# EAGLE design BANTI (EAGLE 9.6.1)
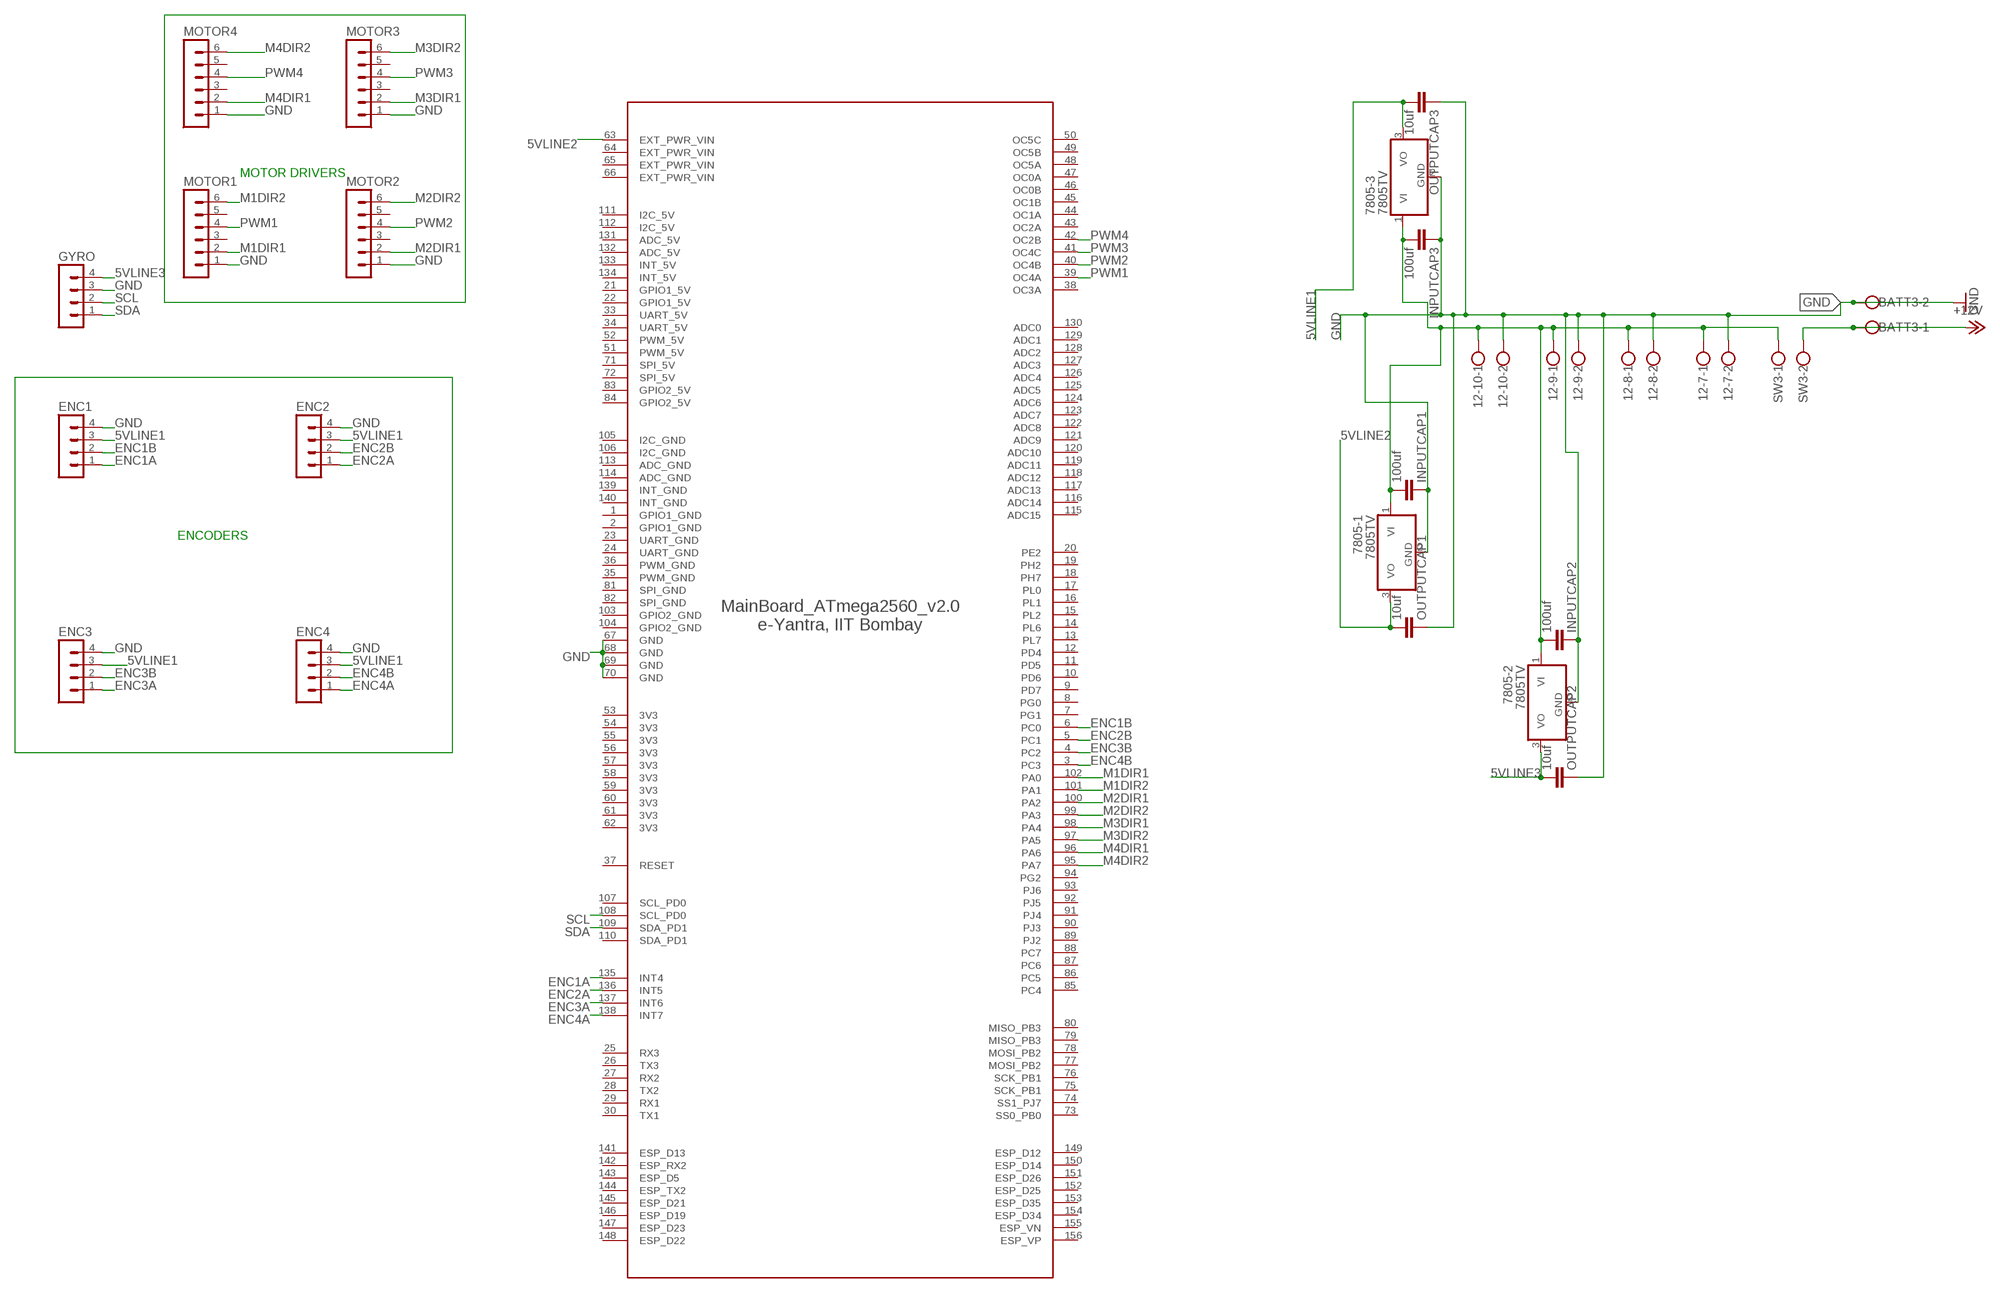
[diagram p0: schematic, sheet 1]

## Parts
12-7  W237-102  [W237-102]
12-8  W237-102  [W237-102]
12-9  W237-102  [W237-102]
12-10  W237-102  [W237-102]
7805-1  7805TV  [TO220V]
7805-2  7805TV  [TO220V]
7805-3  7805TV  [TO220V]
BATT3  W237-102  [W237-102]
ENC1  MA04-1  [MA04-1]
ENC2  MA04-1  [MA04-1]
ENC3  MA04-1  [MA04-1]
ENC4  MA04-1  [MA04-1]
EYFI  ATMEGA2560_V2.0  [ATMEGA2560_V2.0]
GYRO  MA04-1  [MA04-1]
INPUTCAP1  100uf  C2.5/2  [C2.5-2]
INPUTCAP2  100uf  C2.5/2  [C2.5-2]
INPUTCAP3  100uf  C2.5/2  [C2.5-2]
MOTOR1  MA06-1  [MA06-1]
MOTOR2  MA06-1  [MA06-1]
MOTOR3  MA06-1  [MA06-1]
MOTOR4  MA06-1  [MA06-1]
OUTPUTCAP1  10uf  C2.5/2  [C2.5-2]
OUTPUTCAP2  10uf  C2.5/2  [C2.5-2]
OUTPUTCAP3  10uf  C2.5/2  [C2.5-2]
SW3  W237-102  [W237-102]

## Nets
5VLINE1: 7805-3.3(VO) ENC1.3 ENC2.3 ENC3.3 ENC4.3 OUTPUTCAP3.2
5VLINE2: 7805-1.3(VO) EYFI.63(EXT_PWR_VIN) OUTPUTCAP1.2
5VLINE3: 7805-2.3(VO) GYRO.4 OUTPUTCAP2.2
12VLINE1 [twelvevolt]: 12-7.1 12-8.1 12-9.1 12-10.1 7805-1.1(VI) 7805-2.1(VI) 7805-3.1(VI) INPUTCAP1.2 INPUTCAP2.2 INPUTCAP3.2 SW3.1
+12V: BATT3.1 SW3.2
ENC1A: ENC1.1 EYFI.135(INT4)
ENC1B: ENC1.2 EYFI.6(PC0)
ENC2A: ENC2.1 EYFI.136(INT5)
ENC2B: ENC2.2 EYFI.5(PC1)
ENC3A: ENC3.1 EYFI.137(INT6)
ENC3B: ENC3.2 EYFI.4(PC2)
ENC4A: ENC4.1 EYFI.138(INT7)
ENC4B: ENC4.2 EYFI.3(PC3)
GND: 12-7.2 12-8.2 12-9.2 12-10.2 7805-1.2(GND) 7805-2.2(GND) 7805-3.2(GND) BATT3.2 ENC1.4 ENC2.4 ENC3.4 ENC4.4 EYFI.67(GND) EYFI.68(GND) EYFI.69(GND) EYFI.70(GND) GYRO.3 INPUTCAP1.1 INPUTCAP2.1 INPUTCAP3.1 MOTOR1.1 MOTOR2.1 MOTOR3.1 MOTOR4.1 OUTPUTCAP1.1 OUTPUTCAP2.1 OUTPUTCAP3.1
M1DIR1: EYFI.102(PA0) MOTOR1.2
M1DIR2: EYFI.101(PA1) MOTOR1.6
M2DIR1: EYFI.100(PA2) MOTOR2.2
M2DIR2: EYFI.99(PA3) MOTOR2.6
M3DIR1: EYFI.98(PA4) MOTOR3.2
M3DIR2: EYFI.97(PA5) MOTOR3.6
M4DIR1: EYFI.96(PA6) MOTOR4.2
M4DIR2: EYFI.95(PA7) MOTOR4.6
PWM1: EYFI.39(OC4A) MOTOR1.4
PWM2: EYFI.40(OC4B) MOTOR2.4
PWM3: EYFI.41(OC4C) MOTOR3.4
PWM4: EYFI.42(OC2B) MOTOR4.4
SCL: EYFI.108(SCL_PD0) GYRO.2
SDA: EYFI.109(SDA_PD1) GYRO.1
Unconnected: EYFI.7(PG1) EYFI.8(PG0) EYFI.9(PD7) EYFI.10(PD6) EYFI.11(PD5) EYFI.12(PD4) EYFI.13(PL7) EYFI.14(PL6) EYFI.15(PL2) EYFI.16(PL1) EYFI.17(PL0) EYFI.18(PH7) EYFI.19(PH2) EYFI.20(PE2) EYFI.25(RX3) EYFI.26(TX3) EYFI.27(RX2) EYFI.28(TX2) EYFI.29(RX1) EYFI.30(TX1) EYFI.37(RESET) EYFI.38(OC3A) EYFI.43(OC2A) EYFI.44(OC1A) EYFI.45(OC1B) EYFI.46(OC0B) EYFI.47(OC0A) EYFI.48(OC5A) EYFI.49(OC5B) EYFI.50(OC5C) EYFI.73(SS0_PB0) EYFI.74(SS1_PJ7) EYFI.75(SCK_PB1) EYFI.76(SCK_PB1) EYFI.77(MOSI_PB2) EYFI.78(MOSI_PB2) EYFI.79(MISO_PB3) EYFI.80(MISO_PB3) EYFI.85(PC4) EYFI.86(PC5) EYFI.87(PC6) EYFI.88(PC7) EYFI.89(PJ2) EYFI.90(PJ3) EYFI.91(PJ4) EYFI.92(PJ5) EYFI.93(PJ6) EYFI.94(PG2) EYFI.107(SCL_PD0) EYFI.110(SDA_PD1) EYFI.115(ADC15) EYFI.116(ADC14) EYFI.117(ADC13) EYFI.118(ADC12) EYFI.119(ADC11) EYFI.120(ADC10) EYFI.121(ADC9) EYFI.122(ADC8) EYFI.123(ADC7) EYFI.124(ADC6) EYFI.125(ADC5) EYFI.126(ADC4) EYFI.127(ADC3) EYFI.128(ADC2) EYFI.129(ADC1) EYFI.130(ADC0) EYFI.141(ESP_D13) EYFI.142(ESP_RX2) EYFI.143(ESP_D5) EYFI.144(ESP_TX2) EYFI.145(ESP_D21) EYFI.146(ESP_D19) EYFI.147(ESP_D23) EYFI.148(ESP_D22) EYFI.149(ESP_D12) EYFI.150(ESP_D14) EYFI.151(ESP_D26) EYFI.152(ESP_D25) EYFI.153(ESP_D35) EYFI.154(ESP_D34) EYFI.155(ESP_VN) EYFI.156(ESP_VP) MOTOR1.3 MOTOR1.5 MOTOR2.3 MOTOR2.5 MOTOR3.3 MOTOR3.5 MOTOR4.3 MOTOR4.5

## Notes on the sheet
- MOTOR DRIVERS
- ENCODERS

## Power pins joined to a net without a drawn wire
3V3: EYFI.53(3V3) EYFI.54(3V3) EYFI.55(3V3) EYFI.56(3V3) EYFI.57(3V3) EYFI.58(3V3) EYFI.59(3V3) EYFI.60(3V3) EYFI.61(3V3) EYFI.62(3V3)
ADC_5V: EYFI.131(ADC_5V) EYFI.132(ADC_5V)
ADC_GND: EYFI.113(ADC_GND) EYFI.114(ADC_GND)
EXT_PWR_VIN: EYFI.64(EXT_PWR_VIN) EYFI.65(EXT_PWR_VIN) EYFI.66(EXT_PWR_VIN)
GPIO1_5V: EYFI.21(GPIO1_5V) EYFI.22(GPIO1_5V)
GPIO1_GND: EYFI.1(GPIO1_GND) EYFI.2(GPIO1_GND)
GPIO2_5V: EYFI.83(GPIO2_5V) EYFI.84(GPIO2_5V)
GPIO2_GND: EYFI.103(GPIO2_GND) EYFI.104(GPIO2_GND)
I2C_5V: EYFI.111(I2C_5V) EYFI.112(I2C_5V)
I2C_GND: EYFI.105(I2C_GND) EYFI.106(I2C_GND)
INT_5V: EYFI.133(INT_5V) EYFI.134(INT_5V)
INT_GND: EYFI.139(INT_GND) EYFI.140(INT_GND)
PWM_5V: EYFI.51(PWM_5V) EYFI.52(PWM_5V)
PWM_GND: EYFI.35(PWM_GND) EYFI.36(PWM_GND)
SPI_5V: EYFI.71(SPI_5V) EYFI.72(SPI_5V)
SPI_GND: EYFI.81(SPI_GND) EYFI.82(SPI_GND)
UART_5V: EYFI.33(UART_5V) EYFI.34(UART_5V)
UART_GND: EYFI.23(UART_GND) EYFI.24(UART_GND)

## Library data of the parts
12-7-12-10 BATT3 SW3 = con-wago-500:W237-102: WAGO SCREW CLAMP; MPN: 237-102; OC_FARNELL: unknown; OC_NEWARK: 70K9898
7805-1-7805-3 = linear:78*: Positive VOLTAGE REGULATOR Source: http://cache.national.com/ds/LM/LM78L05.pdf http://www.fairchildsemi.com/ds/LM/LM7805.pdf
ENC1-ENC4 GYRO = con-lstb:MA04-1: PIN HEADER; OC_FARNELL: unknown; OC_NEWARK: unknown
EYFI = eYFi-Mega_v2.0.1:ATMEGA2560_V2.0
INPUTCAP1-INPUTCAP3 OUTPUTCAP1-OUTPUTCAP3 = capacitor-wima:C: CAPACITOR naming: grid - package width
MOTOR1-MOTOR4 = con-lstb:MA06-1: PIN HEADER; OC_FARNELL: unknown; OC_NEWARK: unknown

## Net classes
0 default: width 0.7 mm, drill 0.508 mm, clearance 0.254 mm
1 New Class: width 1 mm, drill 0.508 mm, clearance 0.254 mm
2 twelvevolt: width 2 mm, drill 0.508 mm, clearance 0.254 mm

## Board
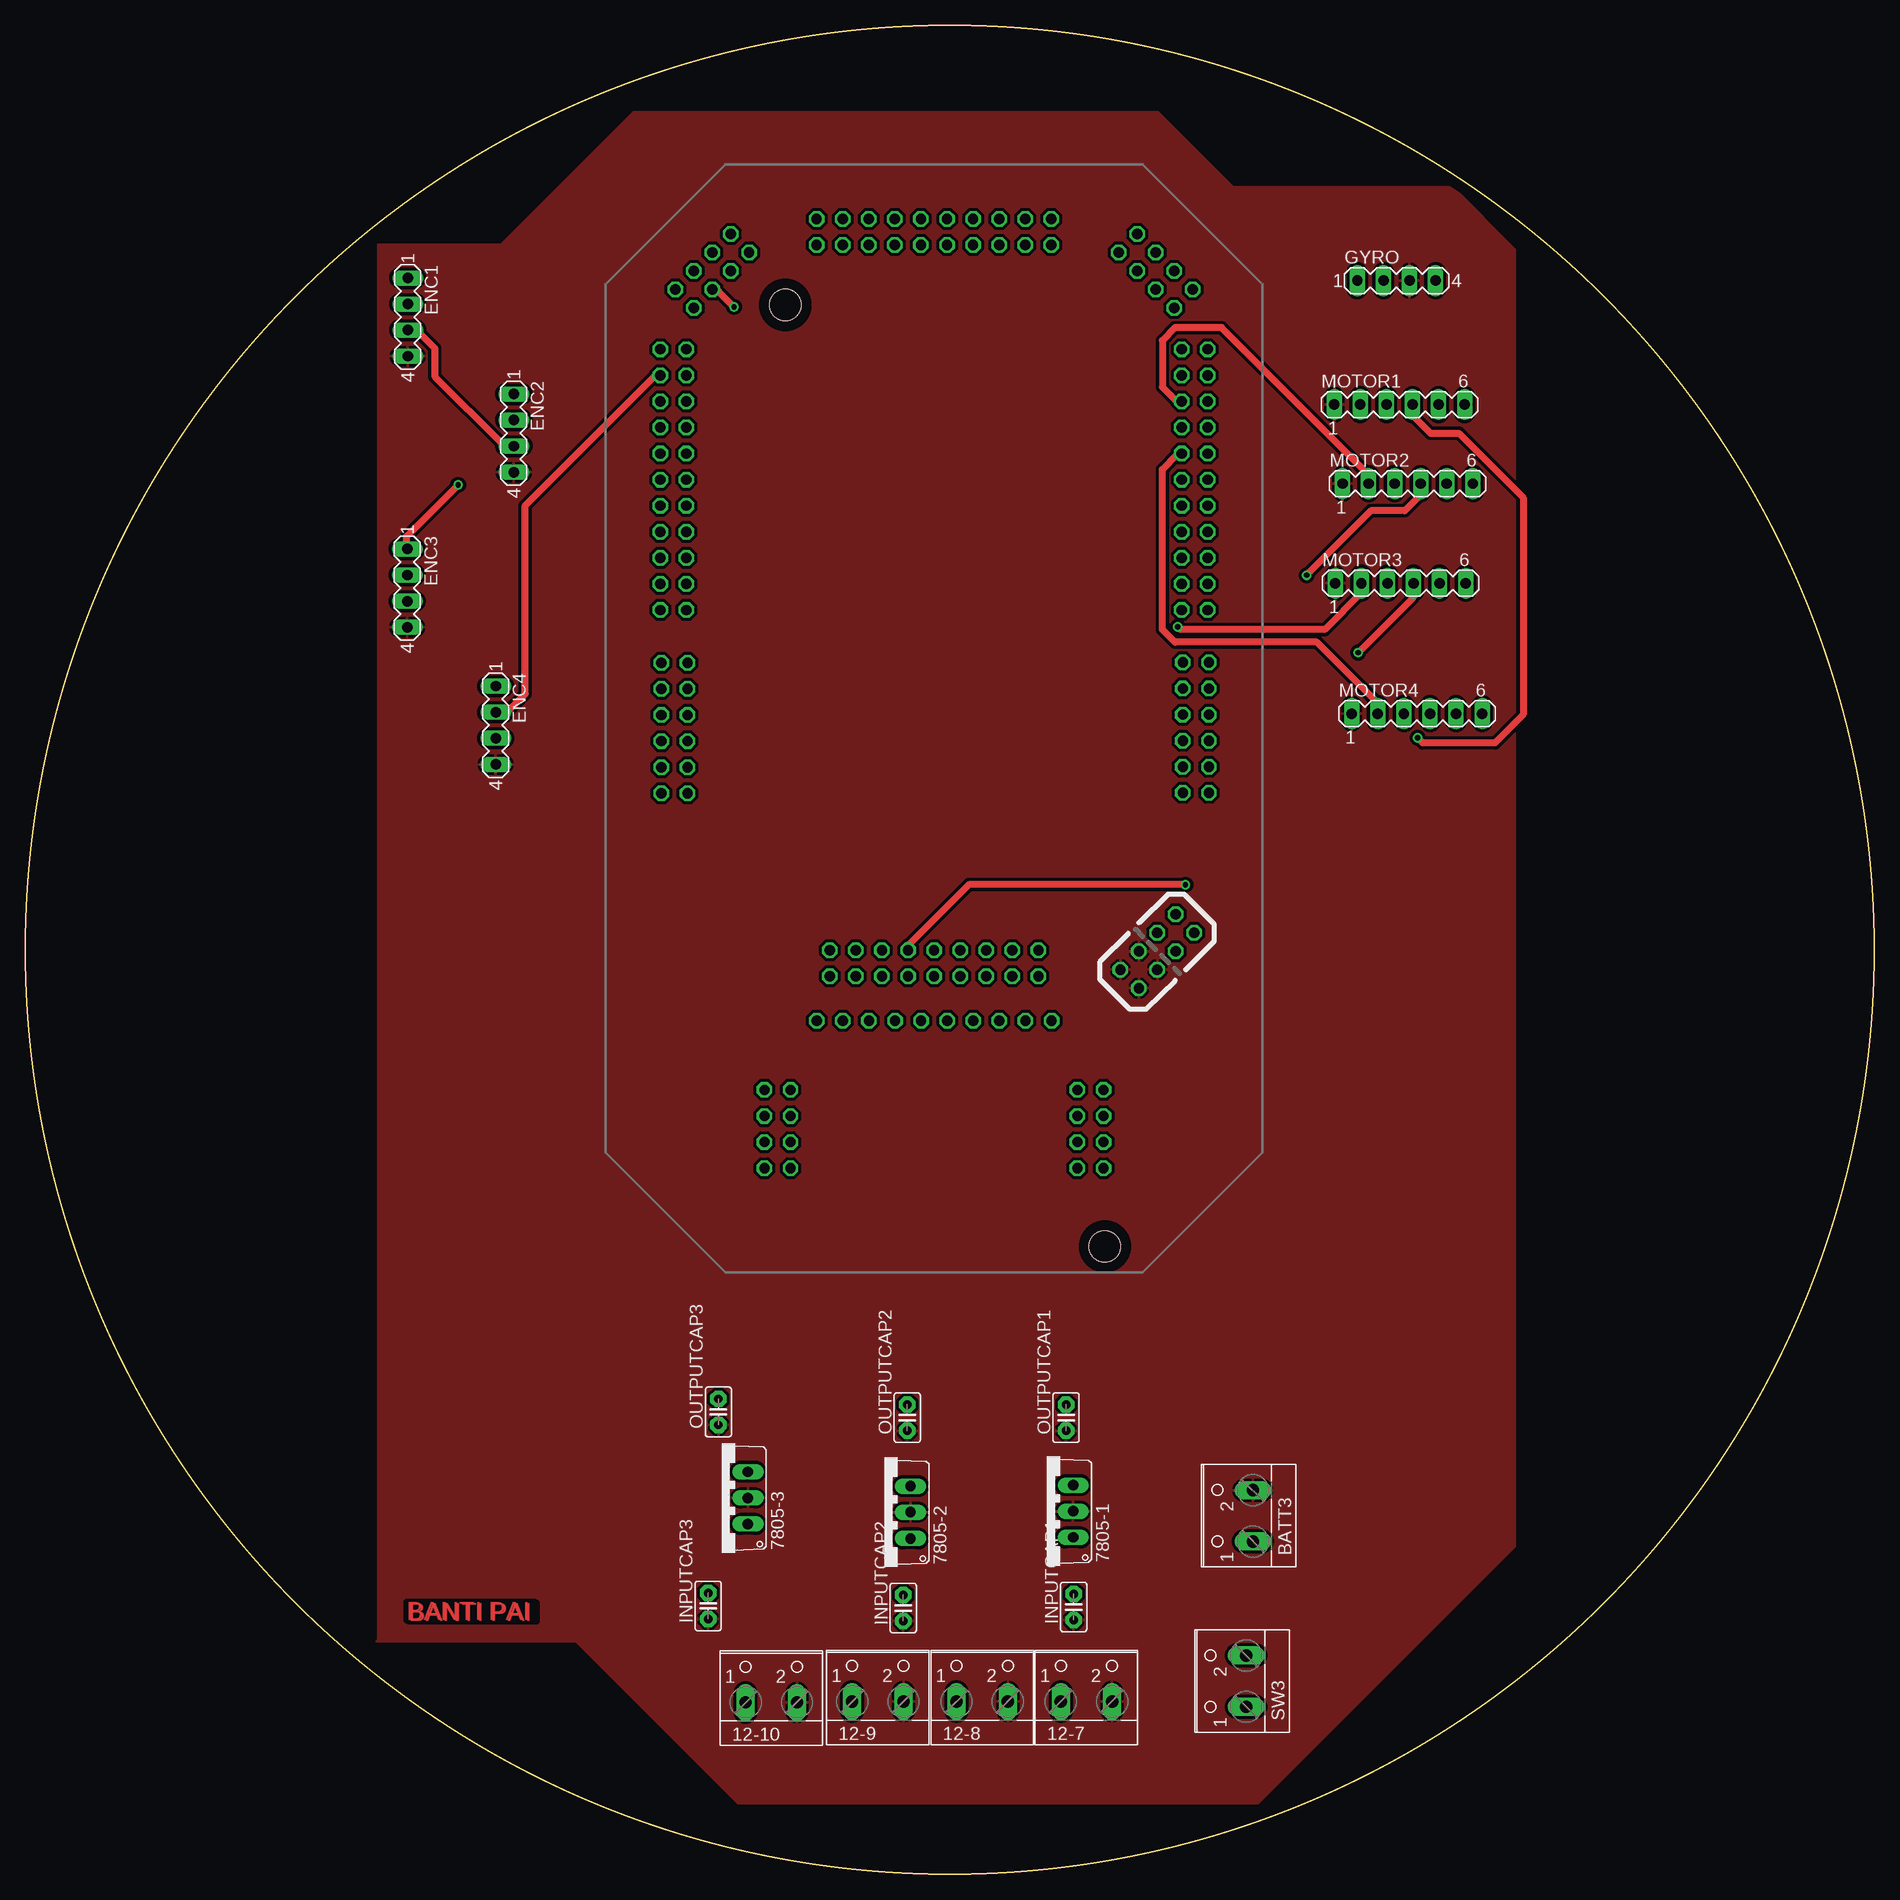
[diagram p1: board, top side]
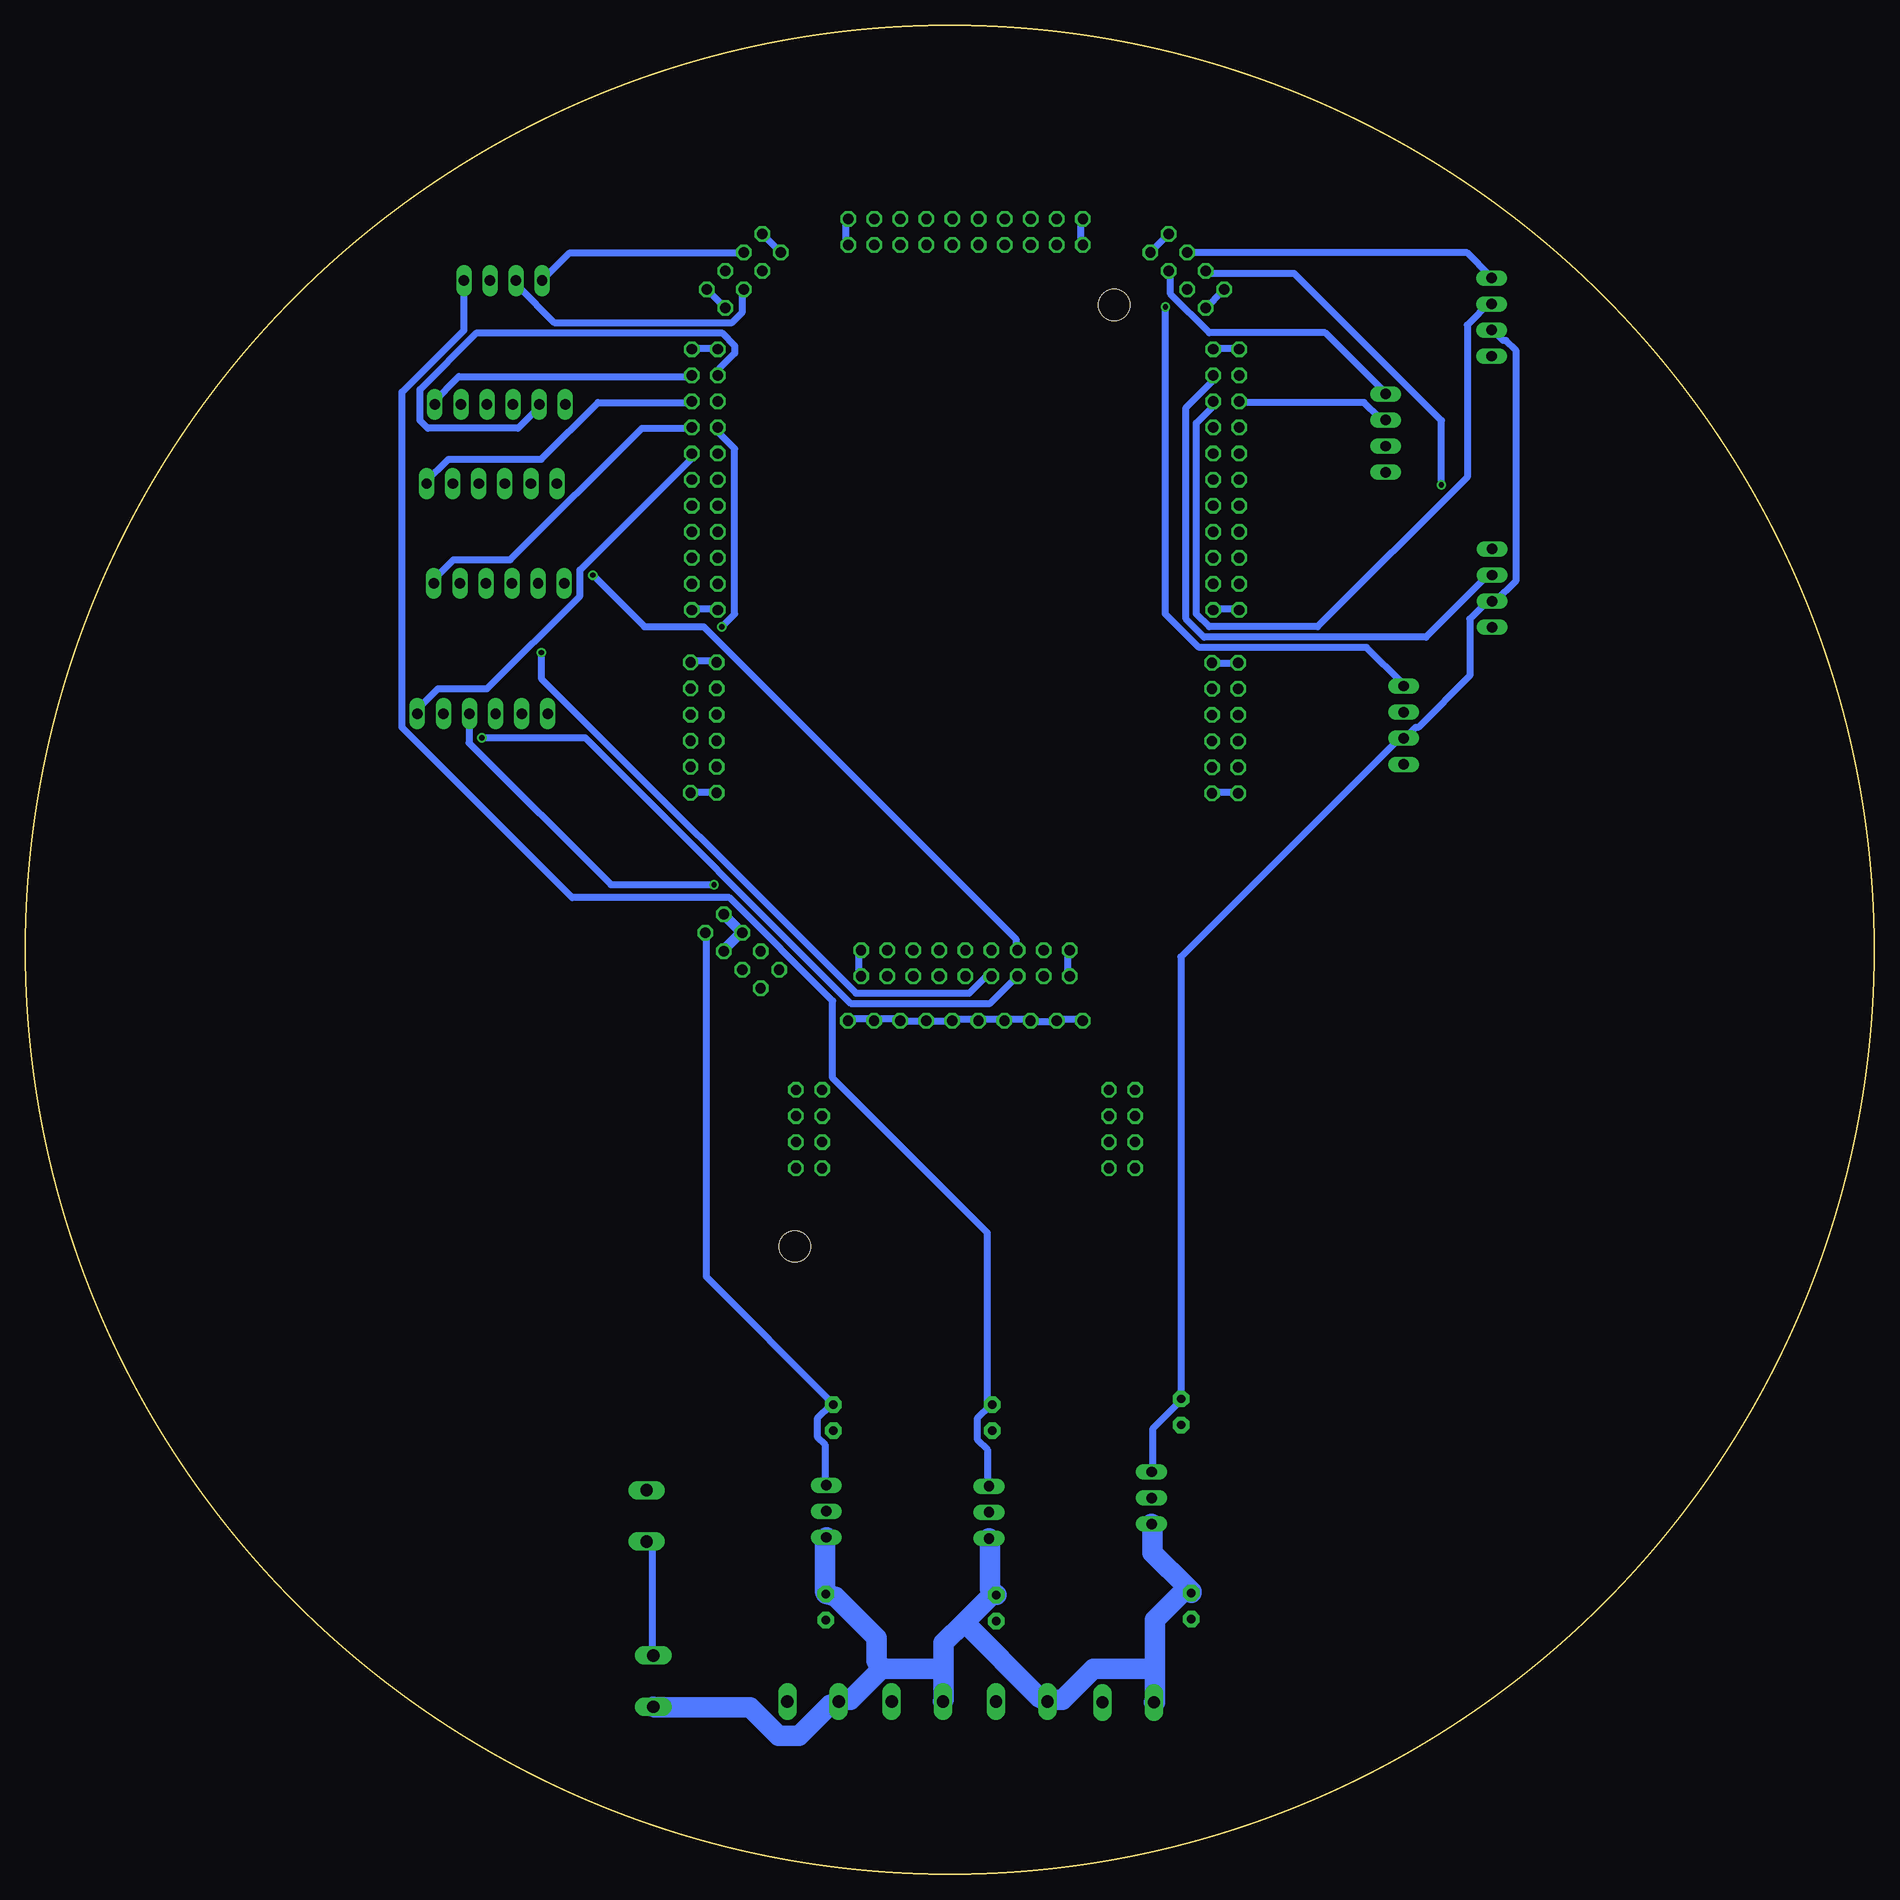
[diagram p2: board, bottom side, seen from below]

Size 180 x 180 mm. Coordinates in mm from the lower left corner, seen from the top.
Outline: circle at 90,90 radius 90
Copper layers (1*16): Top 0.035mm / dielectric 1.5mm / Bottom 0.035mm
Design rules "default *": minimum track width 12mil, minimum drill 0.35mm, track to track 12mil, track to pad 12mil, pad to pad 12mil, via to via 12mil, smd to smd 12mil, copper to edge 40mil, drill to drill 6mil, minimum pad ring 10mil, minimum via ring 8mil, stop-mask expansion 4mil, vias tented up to drill 0mil, thermal gap 10mil

### Footprints (pad centres in the part's own frame; a part is rotated, then mirrored left to right if it is on the bottom)
W237-102 = drill 1.194 long: 1 -2.5,-1.27; 2 2.5,-1.27
TO220V = drill 1.016 long: 1 -2.54,-2.54; 2 0,-2.54; 3 2.54,-2.54
MA04-1 = drill 1.016 long: 1 -3.81,0; 2 -1.27,0; 3 1.27,0; 4 3.81,0
ATMEGA2560_V2.0 = drill 1 octagon: 1 5.344,89.916; 2 7.884,89.916; 3 5.344,87.376; 4 7.884,87.376; 5 5.344,84.836; 6 7.884,84.836; 7 5.344,82.296; 8 7.884,82.296; 9 5.344,79.756; 10 7.884,79.756; 11 5.344,77.216; 12 7.884,77.216; 13 5.344,74.676; 14 7.884,74.676; 15 5.344,72.136; 16 7.884,72.136; 17 5.344,69.596; 18 7.884,69.596; 19 5.344,67.056; 20 7.884,67.056; 21 5.344,64.516; 22 7.884,64.516; 23 5.461,59.373; 24 8.001,59.373; 25 5.461,56.833; 26 8.001,56.833; 27 5.461,54.292; 28 8.001,54.292; 29 5.461,51.752; 30 8.001,51.752; 31 5.461,49.212; 32 8.001,49.212; 33 5.461,46.672; 34 8.001,46.672; 35 21.857,28.839; 36 21.857,31.379; 37 24.397,28.839; 38 24.397,31.379; 39 26.937,28.839; 40 26.937,31.379; 41 29.477,28.839; 42 29.477,31.379; 43 32.017,28.839; 44 32.017,31.379; 45 34.557,28.839; 46 34.557,31.379; 47 37.097,28.839; 48 37.097,31.379; 49 39.637,28.839; 50 39.637,31.379; 51 42.177,28.839; 52 42.177,31.379; 53 20.592,24.511; 54 23.132,24.511; 55 25.672,24.511; 56 28.212,24.511; 57 30.752,24.511; 58 33.292,24.511; 59 35.832,24.511; 60 38.372,24.511; 61 40.912,24.511; 62 43.452,24.511; 63 57.348,33.078; 64 55.552,34.874; 65 55.552,31.282; 66 53.756,33.078; 67 53.756,29.486; 68 51.96,31.282; 69 51.96,27.69; 70 50.164,29.486; 71 58.783,46.711; 72 56.243,46.711; 73 58.783,49.251; 74 56.243,49.251; 75 58.783,51.791; 76 56.243,51.791; 77 58.783,54.331; 78 56.243,54.331; 79 58.783,56.871; 80 56.243,56.871; 81 58.783,59.411; 82 56.243,59.411; 83 58.674,64.516; 84 56.134,64.516; 85 58.674,67.056; 86 56.134,67.056; 87 58.674,69.596; 88 56.134,69.596; 89 58.674,72.136; 90 56.134,72.136; 91 58.674,74.676; 92 56.134,74.676; 93 58.674,77.216; 94 56.134,77.216; 95 58.674,79.756; 96 56.134,79.756; 97 58.674,82.296; 98 56.134,82.296; 99 58.674,84.836; 100 56.134,84.836; 101 58.674,87.376; 102 56.134,87.376; 103 58.674,89.916; 104 56.134,89.916; 105 57.192,95.746; 106 55.396,93.95; 107 55.396,97.542; 108 53.6,95.746; 109 53.6,99.338; 110 51.804,97.542; 111 51.804,101.135; 112 50.008,99.338; 113 43.434,102.616; 114 43.434,100.076; 115 40.894,102.616; 116 40.894,100.076; 117 38.354,102.616; 118 38.354,100.076; 119 35.814,102.616; 120 35.814,100.076; 121 33.274,102.616; 122 33.274,100.076; 123 30.734,102.616; 124 30.734,100.076; 125 28.194,102.616; 126 28.194,100.076; 127 25.654,102.616; 128 25.654,100.076; 129 23.114,102.616; 130 23.114,100.076; 131 20.574,102.616; 132 20.574,100.076; 133 12.208,101.133; 134 14.004,99.337; 135 10.411,99.337; 136 12.208,97.541; 137 8.615,97.541; 138 10.411,95.745; 139 6.819,95.745; 140 8.615,93.949; 141 15.494,17.78; 142 18.034,17.78; 143 15.494,15.24; 144 18.034,15.24; 145 15.494,12.7; 146 18.034,12.7; 147 15.494,10.16; 148 18.034,10.16; 149 45.974,17.78; 150 48.514,17.78; 151 45.974,15.24; 152 48.514,15.24; 153 45.974,12.7; 154 48.514,12.7; 155 45.974,10.16; 156 48.514,10.16 | hole 3.048: 17.526,94.234; 48.641,2.54
C2.5-2 = drill 0.813 pad 1.6 octagon: 1 -1.27,0; 2 1.27,0
MA06-1 = drill 1.016 long: 1 -6.35,0; 2 -3.81,0; 3 -1.27,0; 4 1.27,0; 5 3.81,0; 6 6.35,0

### Placement (x,y rotation side)
12-7  103.31,18.05 0 top
12-8  93.15,18.05 0 top
12-9  82.99,18.05 0 top
12-10  72.62,17.97 0 top
7805-1  99.47,35.31 90 top
7805-2  83.64,35.21 90 top
7805-3  67.81,36.61 90 top
BATT3  118.26,34.87 90 top
ENC1  37.21,151.62 270 top
ENC2  47.54,140.32 270 top
ENC3  37.17,125.22 270 top
ENC4  45.78,111.87 270 top
EYFI  56.46,58.57 0 top
GYRO  133.51,155.17 0 top
INPUTCAP1  102.07,25.99 90 top
INPUTCAP2  85.47,25.89 90 top
INPUTCAP3  66.47,26.09 90 top
MOTOR1  133.8,143.1 0 top
MOTOR2  134.6,135.4 0 top
MOTOR3  133.9,125.7 0 top
MOTOR4  135.5,113 0 top
OUTPUTCAP1  101.33,44.43 90 top
OUTPUTCAP2  85.86,44.43 90 top
OUTPUTCAP3  67.47,44.99 90 top
SW3  117.6,18.77 90 top

### Tracks (layer width: path | path; a pad name or v marks a point on that pad's centre or on a via)
3V3
  Bottom 0.7: EYFI.53 77.28,83.27 79.54,83.27 EYFI.54 79.79,83.02 81.8,83.02 EYFI.55 82.31,83.27 84.57,83.27 EYFI.56 84.82,83.27 87.08,83.27 EYFI.57 87.33,83.27 89.59,83.27 EYFI.58 90.09,83.02 92.1,83.02 EYFI.59 92.61,83.02 94.62,83.02 EYFI.60 95.12,83.27 97.13,83.27 EYFI.61 97.63,83.27 99.89,83.27 EYFI.62
5VLINE1
  Top 0.7: ENC2.3 47.39,139.29 46.39,139.29 39.85,145.82 39.85,148.58 38.1,150.34 37.34,150.34 ENC1.3
  Bottom 0.7: 7805-3.3 70.25,39.31 70.25,43.33 67.49,46.09 OUTPUTCAP3.2 67.49,46.6 67.49,89.3 46.13,110.65 ENC4.3 45.63,110.65 44.63,111.66 44.38,111.66 39.35,116.68 39.35,122.21 37.84,123.71 37.34,123.71 ENC3.3 36.84,123.97 34.83,125.97 34.83,148.33 35.83,149.34 36.09,149.34 37.09,150.34 ENC1.3
5VLINE2
  Bottom 0.7: EYFI.63 113.71,91.56 113.71,58.15 101.4,45.84 OUTPUTCAP1.2 101.65,45.59 102.91,44.33 102.91,42.58 102.15,41.82 102.15,38.05 7805-1.3
5VLINE3
  Bottom 0.7: 7805-2.3 86.33,37.8 86.33,41.32 87.33,42.33 87.33,44.33 86.07,45.59 OUTPUTCAP2.2 86.33,45.84 86.33,62.42 101.4,77.49 101.4,85.03 111.45,95.08 126.77,95.08 143.35,111.66 143.35,144.31 137.32,150.34 GYRO.4
12VLINE1
  Bottom 2: 66.86,27.88 66.48,27.5 INPUTCAP3.2 | 66.86,27.88 70.25,31.27 70.25,34.04 7805-3.1 | 70,19.97 70,24.74 66.86,27.88 | 70,19.97 70,16.7 12-10.1 | 70,19.97 76.03,19.97 79.04,16.95 80.3,16.95 12-9.1 81.3,17.21 88.59,24.49 | 7805-1.1 102.15,32.53 102.15,27.5 INPUTCAP1.2 101.15,27 97.13,22.98 97.13,20.72 96.63,19.97 | 85.7,27.38 85.57,27.25 INPUTCAP2.2 | 85.7,27.38 86.07,27.76 86.07,32.53 7805-2.1 | 90.6,19.97 90.6,22.48 88.59,24.49 | 90.6,19.97 90.6,16.95 12-8.1 | 85.7,27.38 88.59,24.49 | 96.63,19.97 99.64,16.95 100.64,16.95 12-7.1 101.65,16.45 104.66,13.44 106.67,13.44 109.44,16.2 118.73,16.2 SW3.1 | 90.6,19.97 96.63,19.97
+12V
  Bottom 0.7: SW3.2 118.98,21.48 118.98,31.77 119.48,32.28 BATT3.1
ADC_5V
  Bottom 0.7: EYFI.132 77.28,158.88 77.28,161.14 EYFI.131
ADC_GND
  Bottom 0.7: EYFI.114 100.14,158.88 100.14,161.14 EYFI.113
ENC1A
  Bottom 0.7: EYFI.135 66.73,157.88 39.6,157.88 37.34,155.62 ENC1.1
ENC1B
  Bottom 0.7: EYFI.6 64.47,143.31 64.47,142.81 65.98,141.3 65.98,122.71 64.72,121.45 54.17,121.45 39.6,136.02 39.6,150.84 37.34,153.1 ENC1.2
ENC2A
  Bottom 0.7: EYFI.136 68.49,155.87 68.49,153.86 64.72,150.09 53.42,150.09 47.64,144.31 ENC2.1
ENC2B
  Bottom 0.7: EYFI.5 61.71,143.31 49.65,143.31 48.14,141.8 47.64,141.8 ENC2.2
ENC3A  (via drill 0.51)
  Top 0.7: v42.11,135.27 37.09,130.25 37.09,129.24 ENC3.1
  Bottom 0.7: v42.11,135.27 42.11,141.55 56.43,155.87 64.97,155.87 EYFI.137
ENC3B
  Bottom 0.7: EYFI.4 64.47,145.82 64.47,145.32 66.98,142.81 66.98,122.21 65.23,120.45 43.62,120.45 37.34,126.73 ENC3.2
ENC4A  (via drill 0.51)
  Top 0.7: v68.99,152.6 67.49,154.11 66.98,154.11 EYFI.138
  Bottom 0.7: v68.99,152.6 68.99,122.71 65.73,119.44 49.4,119.44 45.88,115.93 ENC4.1
ENC4B
  Top 0.7: EYFI.3 61.71,145.82 61.21,145.82 48.65,133.26 48.65,114.92 46.89,113.16 45.88,113.16 ENC4.2
EXT_PWR_VIN
  Bottom 1: EYFI.65 111.95,90.05 110.44,91.56 EYFI.66 110.44,91.81 111.95,93.32 EYFI.64
GND
  pour Top: 58.2,170.6 46.3,158.7 34.3,158.7 34.3,22.8 34.1,22.6 53.6,22.6 69.4,6.8 120,6.8 123.9,10.7 145.1,31.9 145.1,158.2 139,164.3 120.3,164.3 117.6,164.3 110.3,171.6 59.2,171.6 58.3,170.7
GPIO1_5V
  Bottom 0.7: EYFI.21 61.96,123.21 64.22,123.21 EYFI.22
GPIO1_GND
  Bottom 0.7: EYFI.1 61.96,148.58 64.22,148.58 EYFI.2
GPIO2_5V
  Bottom 0.7: EYFI.84 112.7,123.21 114.96,123.21 EYFI.83
GPIO2_GND
  Bottom 0.7: EYFI.104 112.7,148.58 114.96,148.58 EYFI.103
I2C_5V
  Bottom 0.7: EYFI.112 106.67,158.13 108.18,159.64 EYFI.111
I2C_GND
  Bottom 0.7: EYFI.106 111.95,152.6 113.46,154.11 EYFI.105
INT_5V
  Bottom 0.7: EYFI.134 70.25,158.13 68.74,159.64 EYFI.133
INT_GND
  Bottom 0.7: EYFI.139 63.47,154.11 64.97,152.6 EYFI.140
M1DIR1
  Bottom 0.7: EYFI.102 112.45,146.07 112.45,146.57 110.94,148.08 110.94,148.83 112.2,150.09 136.06,150.09 141.59,144.56 141.59,141.55 140.84,140.8 132.04,140.8 129.78,143.06 MOTOR1.2
M1DIR2
  Bottom 0.7: EYFI.101 115.21,145.82 137.82,145.82 140.33,143.31 MOTOR1.6
M2DIR1
  Top 0.7: EYFI.100 112.45,143.56 111.95,143.56 110.69,144.81 110.69,149.34 111.95,150.59 116.47,150.59 130.79,136.27 130.79,135.52 MOTOR2.2
M2DIR2
  Bottom 0.7: EYFI.99 115.21,143.31 124.26,143.31 129.78,137.78 138.83,137.78 141.09,135.52 MOTOR2.6
M3DIR1  (via drill 0.51)
  Top 0.7: v112.2,121.45 112.45,121.2 126.52,121.2 130.03,124.72 130.03,125.47 MOTOR3.2
  Bottom 0.7: v112.2,121.45 110.94,122.71 110.94,138.79 112.45,140.29 112.45,140.8 EYFI.98
M3DIR2
  Bottom 0.7: EYFI.97 115.21,140.8 119.99,140.8 132.8,127.98 138.32,127.98 140.08,126.23 140.08,125.72 MOTOR3.6
M4DIR1
  Top 0.7: EYFI.96 112.45,138.28 112.2,138.28 110.69,136.78 110.69,121.2 111.95,119.95 125.76,119.95 131.54,114.17 131.54,113.16 MOTOR4.2
M4DIR2
  Bottom 0.7: EYFI.95 115.21,138.28 115.21,137.78 126.02,126.98 126.02,124.47 135.06,115.42 139.83,115.42 142.09,113.16 MOTOR4.6
PWM1  (via drill 0.51)
  Top 0.7: v135.56,110.65 136.06,110.15 143.1,110.15 145.86,112.91 145.86,134.01 139.58,140.29 136.82,140.29 135.31,141.8 135.31,143.06 MOTOR1.4
  Bottom 0.7: v135.56,110.65 125.51,110.65 99.64,84.78 86.07,84.78 83.56,87.29 EYFI.39
PWM2  (via drill 0.51)
  Top 0.7: v124.76,126.48 131.04,132.76 134.31,132.76 135.81,134.26 135.81,135.27 MOTOR2.4
  Bottom 0.7: v124.76,126.48 119.74,121.45 113.96,121.45 83.56,91.06 83.56,90.05 EYFI.40
PWM3  (via drill 0.51)
  Top 0.7: v129.78,118.94 135.06,124.22 135.06,125.47 MOTOR3.4
  Bottom 0.7: v129.78,118.94 129.78,116.43 99.14,85.78 88.08,85.78 86.58,87.29 86.07,87.29 EYFI.41
PWM4  (via drill 0.51)
  Top 0.7: v112.95,96.33 91.85,96.33 86.07,90.56 86.07,90.05 EYFI.42
  Bottom 0.7: v112.95,96.33 123,96.33 136.82,110.15 136.82,112.91 MOTOR4.4
PWM_5V
  Bottom 0.7: EYFI.51 98.89,87.54 98.89,89.8 EYFI.52
PWM_GND
  Bottom 0.7: EYFI.35 78.54,87.54 78.54,89.8 EYFI.36
SCL
  Bottom 0.7: EYFI.108 110.19,154.11 110.19,152.1 111.19,151.09 128.53,151.09 132.04,154.61 132.04,155.11 GYRO.2
SDA
  Bottom 0.7: EYFI.109 110.19,157.88 127.02,157.88 129.53,155.37 GYRO.1
SPI_5V
  Bottom 0.7: EYFI.72 112.95,105.38 115.21,105.38 EYFI.71
SPI_GND
  Bottom 0.7: EYFI.82 112.95,118.19 115.21,118.19 EYFI.81
UART_5V
  Bottom 0.7: EYFI.33 61.96,105.38 64.22,105.38 EYFI.34
UART_GND
  Bottom 0.7: EYFI.23 61.96,117.94 64.22,117.94 EYFI.24
(copper drawn outside any net)
  shapes: Top area x1

### Text on the board
Top: BANTI PAI | BANTI PAI